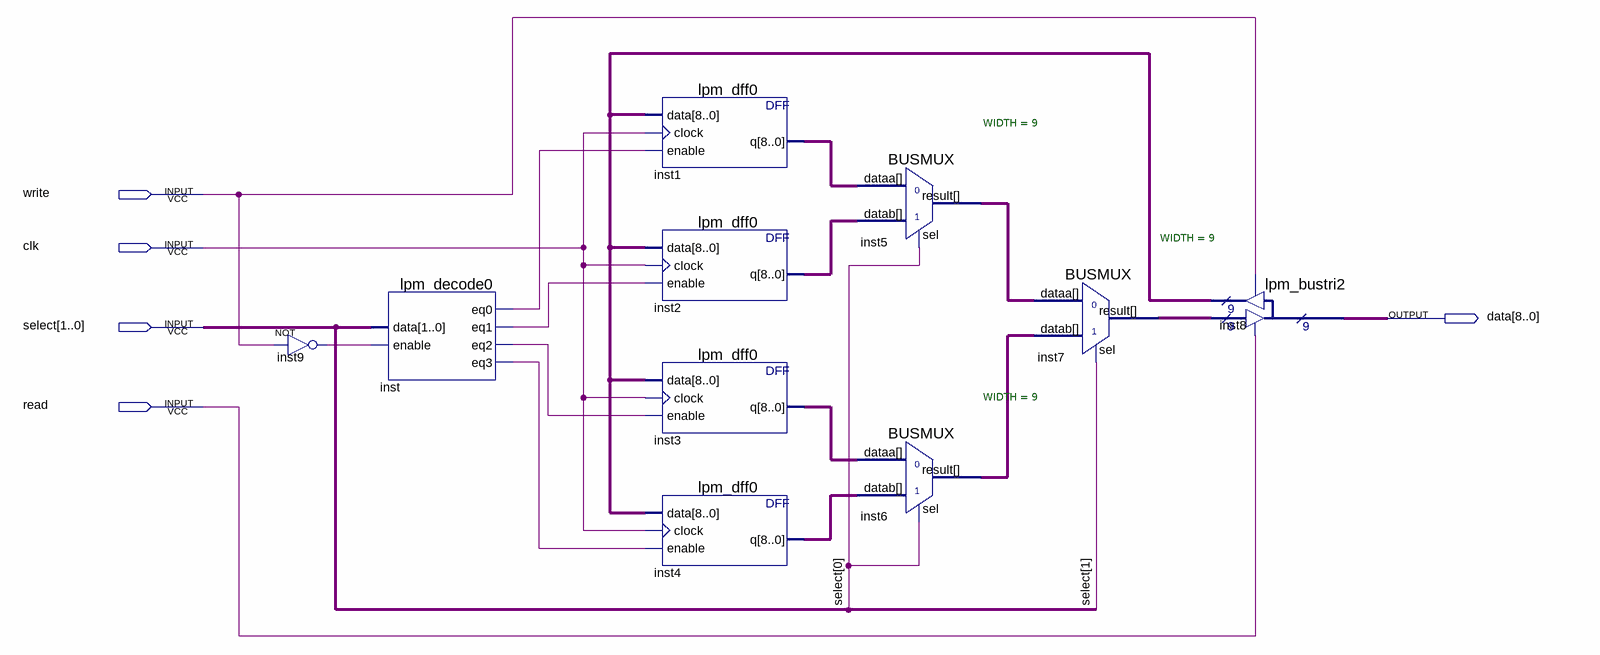
[diagram p0: schematic sheet]
// Quartus schematic gpr.bdf as structural Verilog: 10 symbols, 5 pins
module gpr (
  input  write,
  input  clk,
  input  [1:0] select,
  input  read,
  output [8:0] data
);

  wire inst9_out, inst_eq0, inst_eq1, inst_eq2, inst_eq3;
  wire [8:0] inst1_q, inst2_q, inst3_q, inst4_q, inst5_result, inst6_result, inst7_result, inst8_result;

  not inst9 (inst9_out, write);
  lpm_decode0 inst (.data(select), .enable(inst9_out), .eq0(inst_eq0), .eq1(inst_eq1), .eq2(inst_eq2), .eq3(inst_eq3));
  lpm_dff0 inst1 (.data(inst8_result), .clock(clk), .enable(inst_eq0), .q(inst1_q));
  lpm_dff0 inst2 (.data(inst8_result), .clock(clk), .enable(inst_eq1), .q(inst2_q));
  lpm_dff0 inst3 (.data(inst8_result), .clock(clk), .enable(inst_eq2), .q(inst3_q));
  lpm_dff0 inst4 (.data(inst8_result), .clock(clk), .enable(inst_eq3), .q(inst4_q));
  BUSMUX #(.WIDTH(9)) inst5 (.datab(inst2_q), .sel(select[0]), .dataa(inst1_q), .result(inst5_result));
  BUSMUX #(.WIDTH(9)) inst6 (.datab(inst4_q), .sel(select[0]), .dataa(inst3_q), .result(inst6_result));
  BUSMUX #(.WIDTH(9)) inst7 (.datab(inst6_result), .sel(select[1]), .dataa(inst5_result), .result(inst7_result));
  lpm_bustri2 inst8 (.enabledt(read), .data(inst7_result), .enabletr(write), .result(inst8_result), .tridata(data));
endmodule
